# Altium schematic sheet EST0261_EST026.schdoc
size 127 x 101 mm
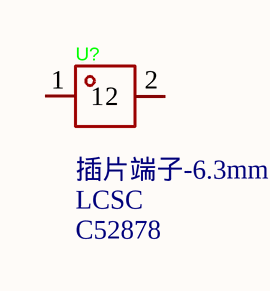
[diagram p0: EST0261_EST026.schdoc]

## Parts
U?  LCSC Part Name: 插片端子-6.3mm  Supplier Part: C52878  Supplier: LCSC  [CONN-TH_L6.3-W0.8-EST026]  (hidden comment: EST026)

## Nets

Not connected (* = marked no-connect by the designer): U? 1 2

## Library data of the parts
U? = EST026: Manufacturer: xcfuse(旭程); Add into BOM: yes; Symbol: EST026; Device: EST026; Manufacturer Part: EST026; Supplier Footprint: 插件; JLCPCB Part Class: Extended Part; Datasheet: https://item.szlcsc.com/datasheet/EST026/53893.html; Convert to PCB: yes